# Altium schematic sheet 3-PWR_BAK_BATT.SCHDOC
size A4
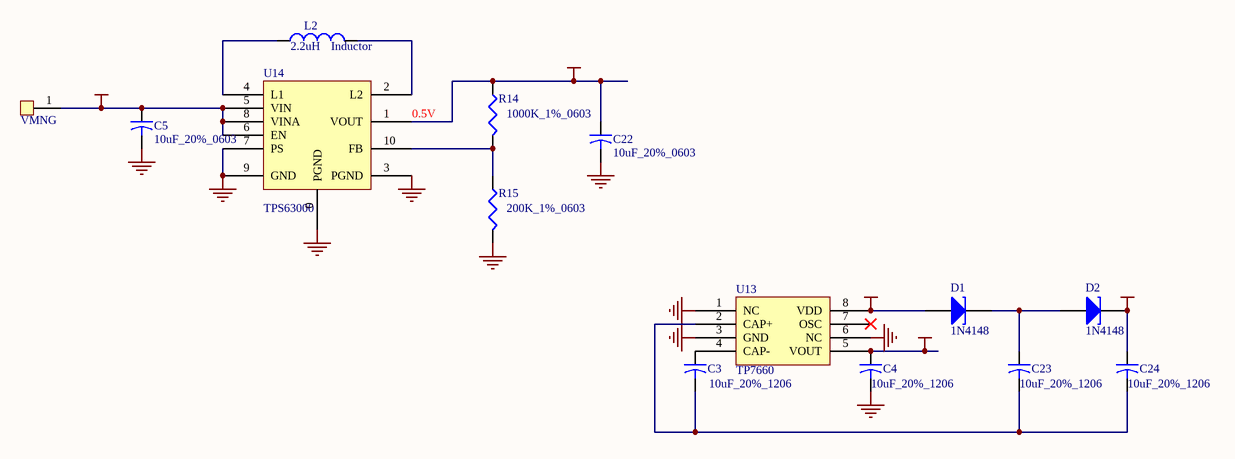
[diagram p0: 3-PWR_BAK_BATT.SCHDOC]

## Parts
C3  10uF_20%_1206  [CC3216-1206]
C4  10uF_20%_1206  [CC3216-1206]
C5  10uF_20%_0603  [C1608-0603]
C22  10uF_20%_0603  [C1608-0603]
C23  10uF_20%_1206  [CC3216-1206]
C24  10uF_20%_1206  [CC3216-1206]
D1  1N4148  [LED0805]
D2  1N4148  [LED0805]
L2  Inductor  value 2.2uH  [L3x3x1.5_5A]
R14  1000K_1%_0603  [C1608-0603]
R15  200K_1%_0603  [C1608-0603]
U13  TP7660  [SO-8]
U14  TPS63000  [QFN-10]
VMNG  ND  [END_3_6]  (value not drawn)

## Nets
GND: C4.2 C5.2 C22.2 R15.2 U13.1(NC) U13.3(GND) U13.6(NC) U14.0(PGND) U14.3(PGND) U14.7(PS) U14.9(GND)
VCC_2V8: C22.1 D1.1(A) R14.1 U13.8(VDD) U14.1(VOUT)
VCC_5V: C24.1 D2.2(K)
VCC_-2V8: C4.1 U13.5(VOUT)
VCC_MNG: C5.1 U14.5(VIN) U14.6(EN) U14.8(VINA) VMNG.1(SW)
NetC3_1: C3.1 U13.4(CAP-)
NetC3_2: C3.2 C23.2 C24.2 U13.2(CAP+)
NetC23_1: C23.1 D1.2(K) D2.1(A)
NetL2_1: L2.1 U14.4(L1)
NetL2_2: L2.2 U14.2(L2)
NetR14_2: R14.2 R15.1 U14.10(FB)

Not connected (* = marked no-connect by the designer): U13 7(OSC)*

## Notes on the sheet
- 0.5V

## Library data of the parts
C3 C4 C23 C24 = Cap2: Capacitor; Value: 10uF; Published: 23-Sep-2002; Publisher: Altium Limited
C5 C22 = Cap2: Capacitor; Value: 0.1uF 20% 0603; Published: 23-Sep-2002; Publisher: Altium Limited
D1 D2 = D Tunnel1: Tunnel Diode - RLC Model; Published: 8-Jun-2000; LatestRevisionDate: 17-Jul-2002; LatestRevisionNote: Re-released for DXP Platform.; Publisher: Altium Limited
R14 R15 = Res3: Resistor; Value: 1K%5 0603; Published: 8-Jun-2000; Revision: July-2002: Re-released for DXP Platform.; Publisher: Altium Limited
L2 = Inductor: Published: 8-Jun-2000; Revision: July-2002: Re-released for DXP Platform.; Publisher: Altium Limited